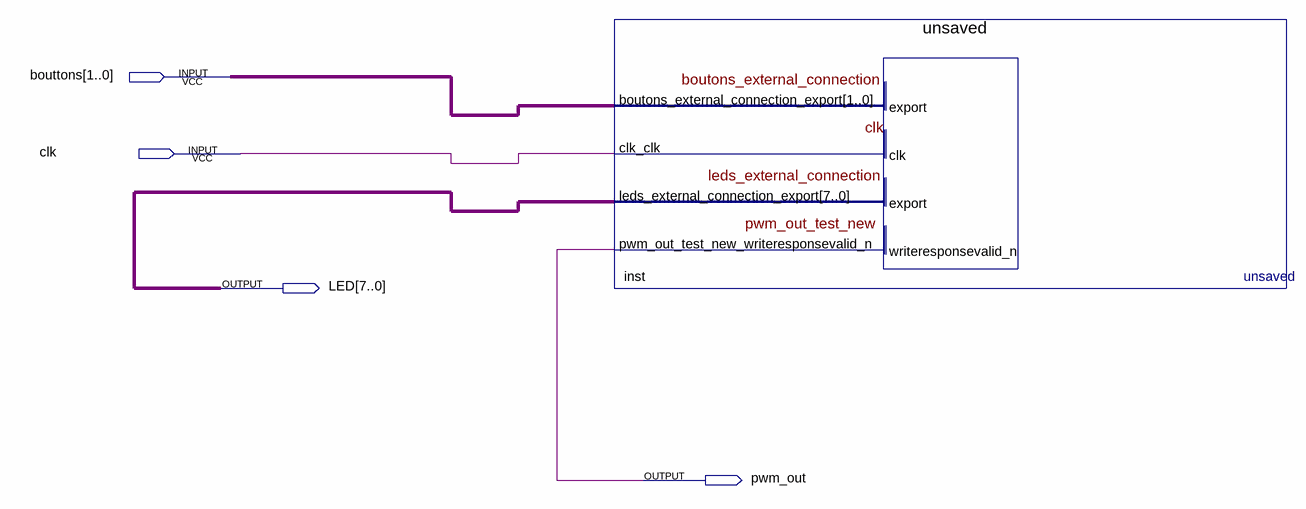
[diagram p0: schematic sheet]
// Quartus schematic sopc_compteur_new.bdf as structural Verilog: 1 symbols, 4 pins
module sopc_compteur_new (
  input  [1:0] bouttons,
  input  clk,
  output [7:0] LED,
  output pwm_out
);

  unsaved inst (
    .boutons_external_connection_export(bouttons), .clk_clk(clk), .leds_external_connection_export(LED),
    .pwm_out_test_new_writeresponsevalid_n(pwm_out));
endmodule
